# EAGLE design cirkel (EAGLE 5.11)
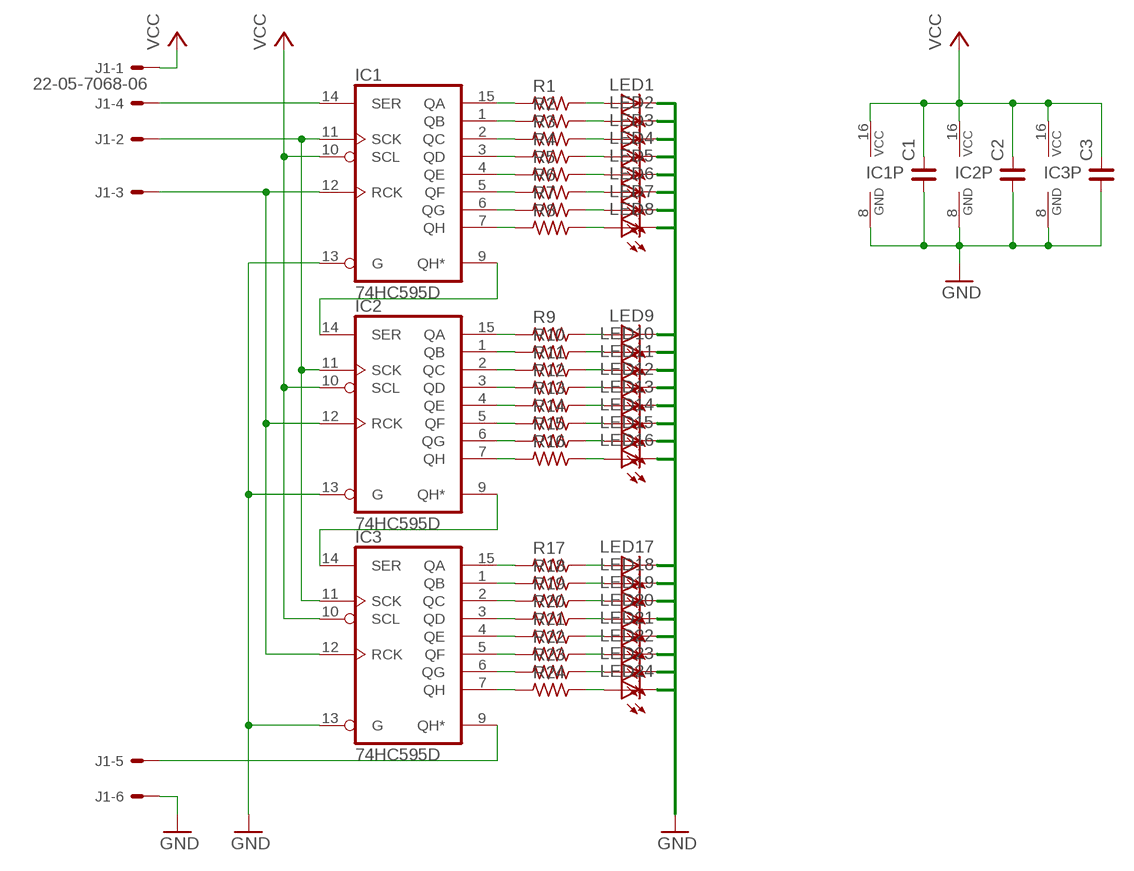
[diagram p0: schematic, sheet 1]

## Parts
C1  C_0805  [C0805]
C2  C_0805  [C0805]
C3  C_0805  [C0805]
IC1  74HC595D  [SO16]
IC2  74HC595D  [SO16]
IC3  74HC595D  [SO16]
J1  22-05-7068-06  [7395-06]
LED1  LEDKA-3528ASYC  [KA-3528ASYC]
LED2  LEDKA-3528ASYC  [KA-3528ASYC]
LED3  LEDKA-3528ASYC  [KA-3528ASYC]
LED4  LEDKA-3528ASYC  [KA-3528ASYC]
LED5  LEDKA-3528ASYC  [KA-3528ASYC]
LED6  LEDKA-3528ASYC  [KA-3528ASYC]
LED7  LEDKA-3528ASYC  [KA-3528ASYC]
LED8  LEDKA-3528ASYC  [KA-3528ASYC]
LED9  LEDKA-3528ASYC  [KA-3528ASYC]
LED10  LEDKA-3528ASYC  [KA-3528ASYC]
LED11  LEDKA-3528ASYC  [KA-3528ASYC]
LED12  LEDKA-3528ASYC  [KA-3528ASYC]
LED13  LEDKA-3528ASYC  [KA-3528ASYC]
LED14  LEDKA-3528ASYC  [KA-3528ASYC]
LED15  LEDKA-3528ASYC  [KA-3528ASYC]
LED16  LEDKA-3528ASYC  [KA-3528ASYC]
LED17  LEDKA-3528ASYC  [KA-3528ASYC]
LED18  LEDKA-3528ASYC  [KA-3528ASYC]
LED19  LEDKA-3528ASYC  [KA-3528ASYC]
LED20  LEDKA-3528ASYC  [KA-3528ASYC]
LED21  LEDKA-3528ASYC  [KA-3528ASYC]
LED22  LEDKA-3528ASYC  [KA-3528ASYC]
LED23  LEDKA-3528ASYC  [KA-3528ASYC]
LED24  LEDKA-3528ASYC  [KA-3528ASYC]
R1  R_0805  [R0805]
R2  R_0805  [R0805]
R3  R_0805  [R0805]
R4  R_0805  [R0805]
R5  R_0805  [R0805]
R6  R_0805  [R0805]
R7  R_0805  [R0805]
R8  R_0805  [R0805]
R9  R_0805  [R0805]
R10  R_0805  [R0805]
R11  R_0805  [R0805]
R12  R_0805  [R0805]
R13  R_0805  [R0805]
R14  R_0805  [R0805]
R15  R_0805  [R0805]
R16  R_0805  [R0805]
R17  R_0805  [R0805]
R18  R_0805  [R0805]
R19  R_0805  [R0805]
R20  R_0805  [R0805]
R21  R_0805  [R0805]
R22  R_0805  [R0805]
R23  R_0805  [R0805]
R24  R_0805  [R0805]

## Nets
GND: C1.1 C2.1 C3.1 IC1.8(GND) IC1.13(G) IC2.8(GND) IC2.13(G) IC3.8(GND) IC3.13(G) J1.6 LED1.C LED2.C LED3.C LED4.C LED5.C LED6.C LED7.C LED8.C LED9.C LED10.C LED11.C LED12.C LED13.C LED14.C LED15.C LED16.C LED17.C LED18.C LED19.C LED20.C LED21.C LED22.C LED23.C LED24.C
N$1: IC1.15(QA) R1.1
N$2: IC1.1(QB) R2.1
N$3: IC1.2(QC) R3.1
N$4: IC1.3(QD) R4.1
N$5: IC1.4(QE) R5.1
N$6: IC1.5(QF) R6.1
N$7: IC1.6(QG) R7.1
N$8: IC1.7(QH) R8.1
N$9: IC2.15(QA) R9.1
N$10: IC2.1(QB) R10.1
N$11: IC2.2(QC) R11.1
N$12: IC2.3(QD) R12.1
N$13: IC2.4(QE) R13.1
N$14: IC2.5(QF) R14.1
N$15: IC2.6(QG) R15.1
N$16: IC2.7(QH) R16.1
N$17: IC3.15(QA) R17.1
N$18: IC3.1(QB) R18.1
N$19: IC3.2(QC) R19.1
N$20: IC3.3(QD) R20.1
N$21: IC3.4(QE) R21.1
N$22: IC3.5(QF) R22.1
N$23: IC3.6(QG) R23.1
N$24: IC3.7(QH) R24.1
N$25: LED1.A R1.2
N$26: LED2.A R2.2
N$27: LED3.A R3.2
N$28: LED4.A R4.2
N$29: LED5.A R5.2
N$30: LED6.A R6.2
N$31: LED7.A R7.2
N$32: LED8.A R8.2
N$33: LED9.A R9.2
N$34: LED10.A R10.2
N$35: LED11.A R11.2
N$36: LED12.A R12.2
N$37: LED13.A R13.2
N$38: LED14.A R14.2
N$39: LED15.A R15.2
N$40: LED16.A R16.2
N$41: LED17.A R17.2
N$42: LED18.A R18.2
N$43: LED19.A R19.2
N$44: LED20.A R20.2
N$45: LED21.A R21.2
N$46: LED22.A R22.2
N$47: LED23.A R23.2
N$48: LED24.A R24.2
N$52: IC1.9(QH*) IC2.14(SER)
N$53: IC2.9(QH*) IC3.14(SER)
N$54: IC1.14(SER) J1.4
N$55: IC1.11(SCK) IC2.11(SCK) IC3.11(SCK) J1.2
N$57: IC1.12(RCK) IC2.12(RCK) IC3.12(RCK) J1.3
N$59: IC3.9(QH*) J1.5
VCC: C1.2 C2.2 C3.2 IC1.10(SCL) IC1.16(VCC) IC2.10(SCL) IC2.16(VCC) IC3.10(SCL) IC3.16(VCC) J1.1

## Library data of the parts
C1-C3 = rc-master:C_: NON-POLARIZED CAP
IC1-IC3 = 74xx-eu:74*595: 8-bit SHIFT REGISTER, output latch
J1 = con-molex:22-?-06: CONNECTOR wire to board 2.54 mm (.1 inch) pitch header; OC_FARNELL: unknown; OC_NEWARK: unknown
LED1-LED24 = led:LED: LED OSRAM: - CHIPLED LG R971, LG N971, LY N971, LG Q971, LY Q971, LO R971, LY R971 LH N974, LH R974 LS Q976, LO Q976, LY Q976 LO Q996 - Hyper CHIPLED LW Q18S LB Q993, LB Q99A, LB R99A - SideLED LS A670, LO A670, LY A670, LG A670, LP A670 LB A673, LV A673, LT A673, LW A673 LH A674 LY A675 LS A676, LA A676, LO A676, LY A676, LW A676 LS A679, LY A679, LG A679 - Hyper Micro SIDELED® LS Y876, LA Y876, LO Y876, LY Y876 LT Y87S - SmartLED LW L88C, LW L88S LB L89C, LB L89S, LG L890 LS L89K, LO L89K, LY L89K LS L896, LA L896, LO L896, LY L896 - TOPLED LS T670, LO T670, LY T670, LG T670, LP T670 LSG T670, LSP T670, LSY T670, LOP T670, LYG T670 LG T671, LOG T671, LSG T671 LB T673, LV T673, LT T673, LW T673 LH T674 LS T676, LA T676, LO T676, LY T676, LB T676, LH T676, LSB T676, LW T676 LB T67C, LV T67C, LT T67C, LS T67K, LO T67K, LY T67K, LW E67C LS E67B, LA E67B, LO E67B, LY E67B, LB E67C, LV E67C, LT E67C LW T67C LS T679, LY T679, LG T679 LS T770, LO T770, LY T770, LG T770, LP T770 LB T773, LV T773, LT T773, LW T773 LH T774 LS E675, LA E675, LY E675, LS T675 LS T776, LA T776, LO T776, LY T776, LB T776 LHGB T686 LT T68C, LB T68C - Hyper Mini TOPLED® LB M676 - Mini TOPLED Santana® LG M470 LS M47K, LO M47K, LY M47K Source: http://www.osram.convergy.de LUXEON: - LUMILED® LXK2-PW12-R00, LXK2-PW12-S00, LXK2-PW14-U00, LXK2-PW14-V00 LXK2-PM12-R00, LXK2-PM12-S00, LXK2-PM14-U00 LXK2-PE12-Q00, LXK2-PE12-R00, LXK2-PE12-S00, LXK2-PE14-T00, LXK2-PE14-U00 LXK2-PB12-K00, LXK2-PB12-L00, LXK2-PB12-M00, LXK2-PB14-N00, LXK2-PB14-P00, LXK2-PB14-Q00 LXK2-PR12-L00, LXK2-PR12-M00, LXK2-PR14-Q00, LXK2-PR14-R00 LXK2-PD12-Q00, LXK2-PD12-R00, LXK2-PD12-S00 LXK2-PH12-R00, LXK2-PH12-S00 LXK2-PL12-P00, LXK2-PL12-Q00, LXK2-PL12-R00 Source: www.luxeon.com KINGBRIGHT: KA-3528ASYC Source: www.kingbright.com
R1-R24 = rc-master:R_: RESISTOR

## Board
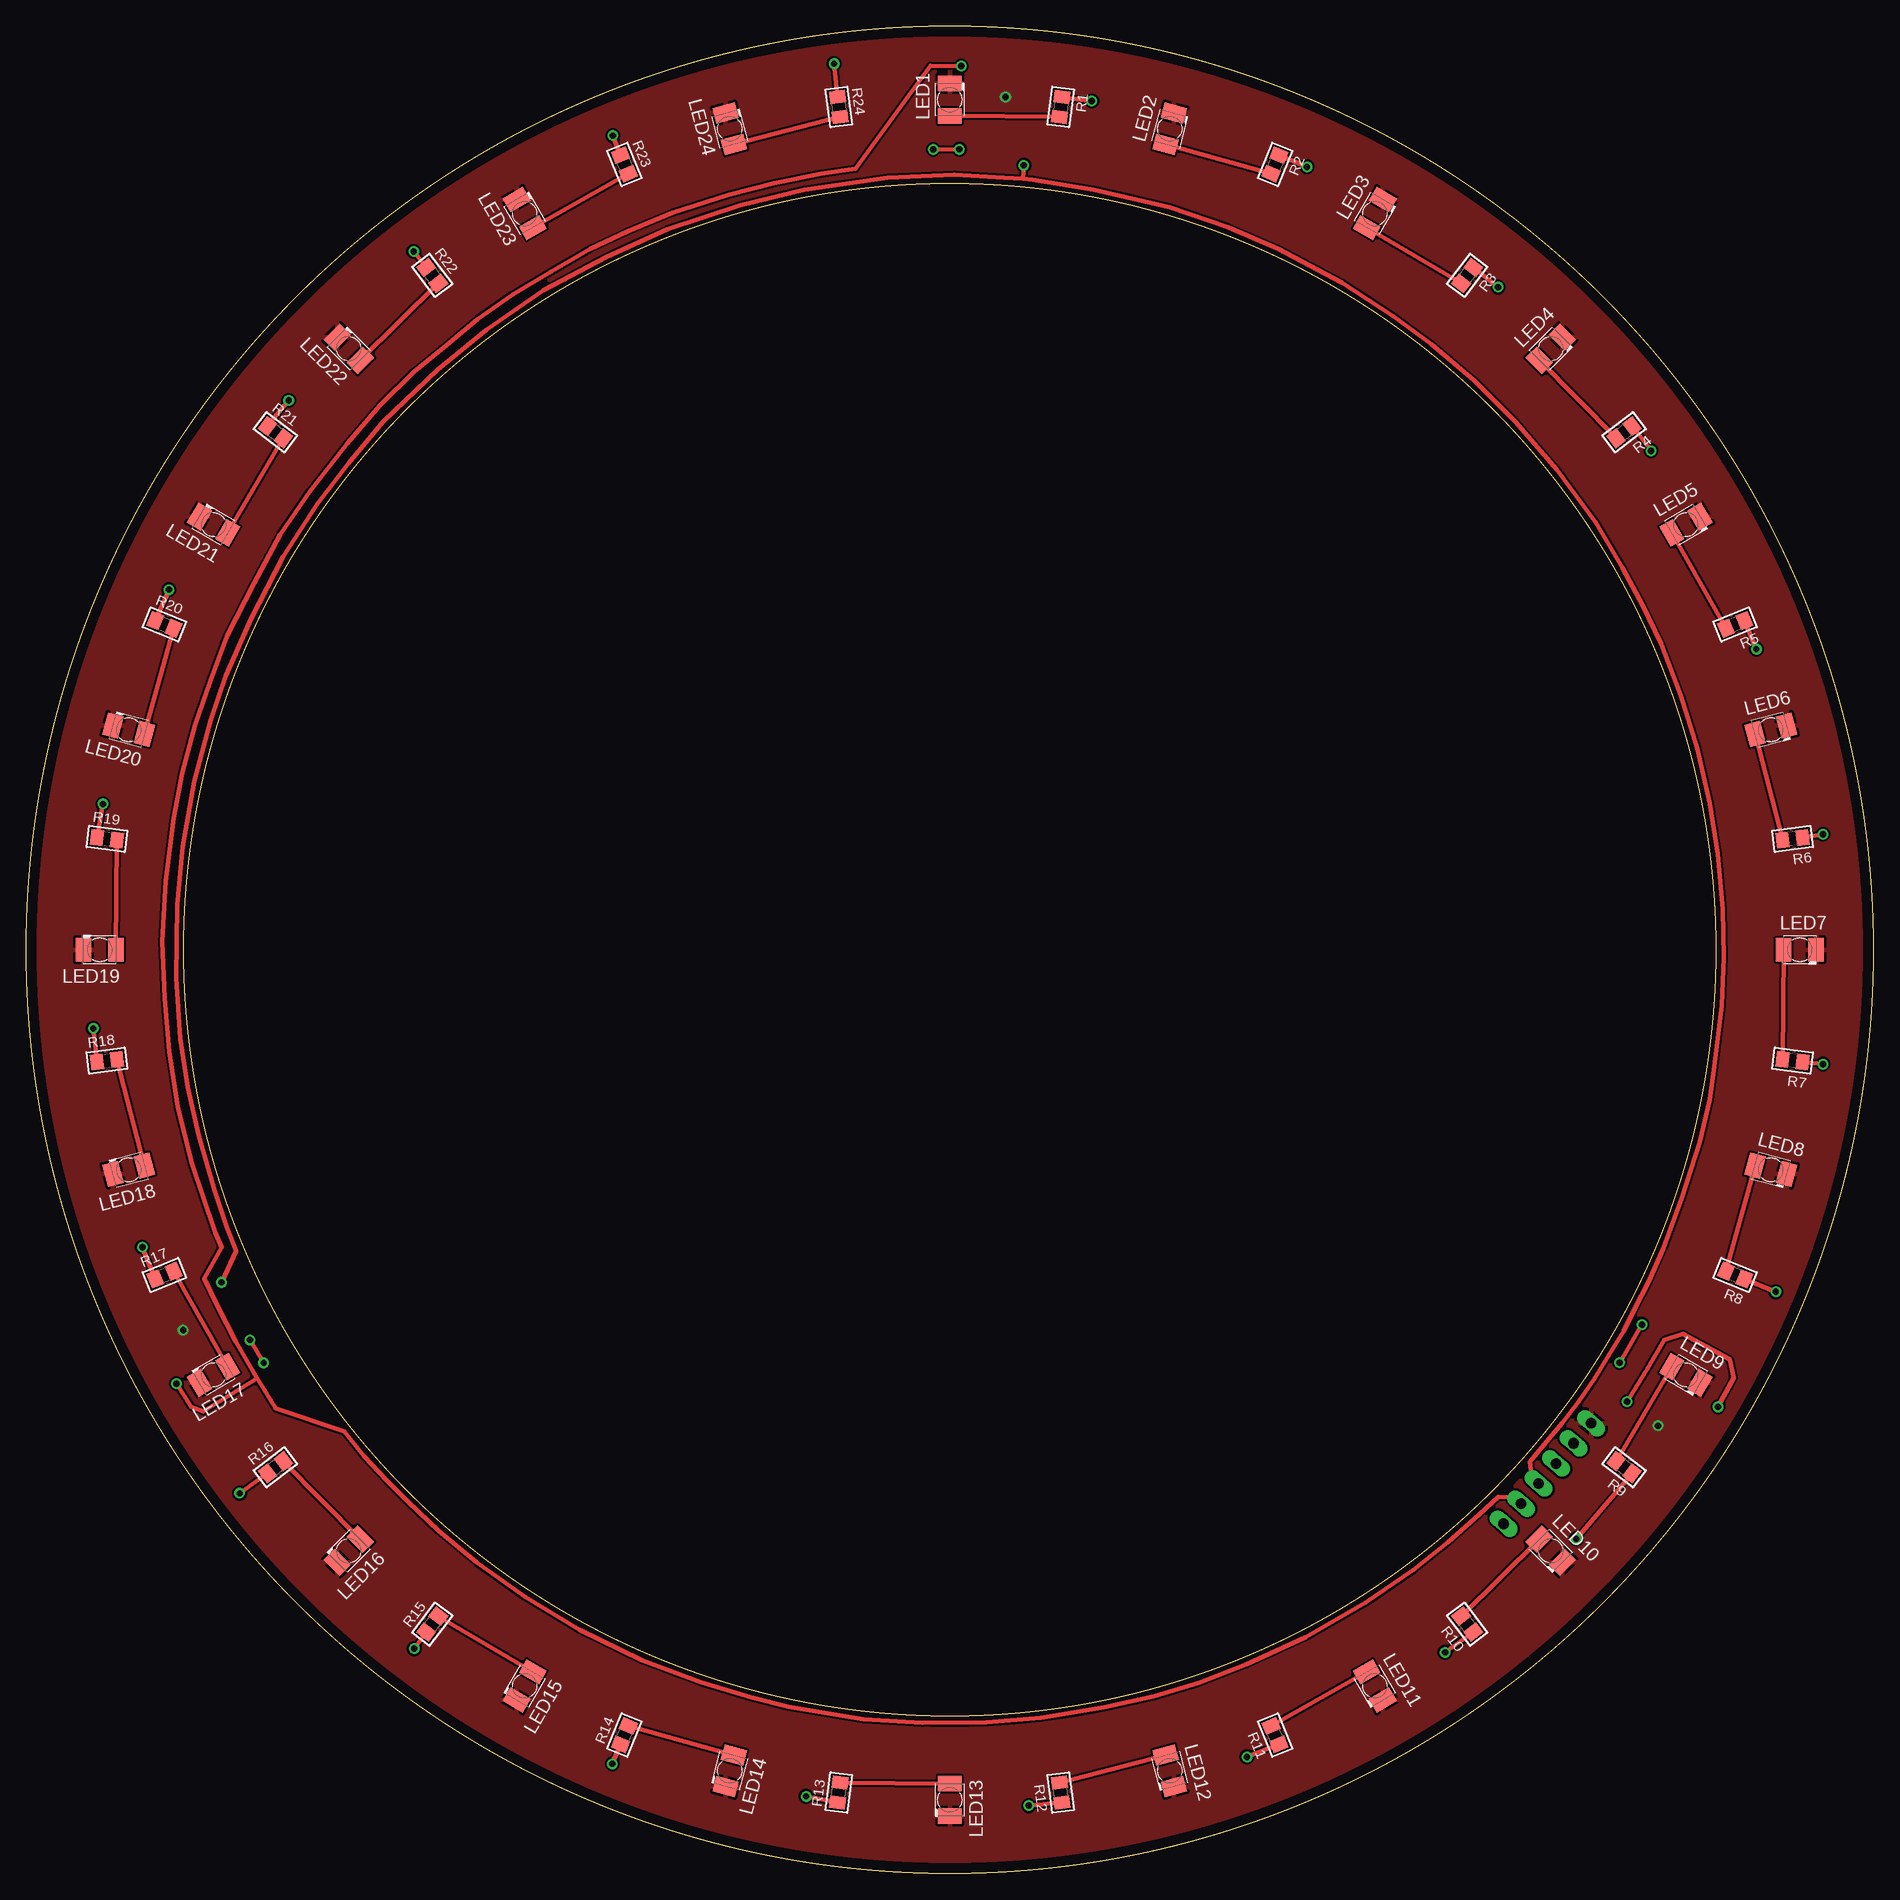
[diagram p1: board, top side]
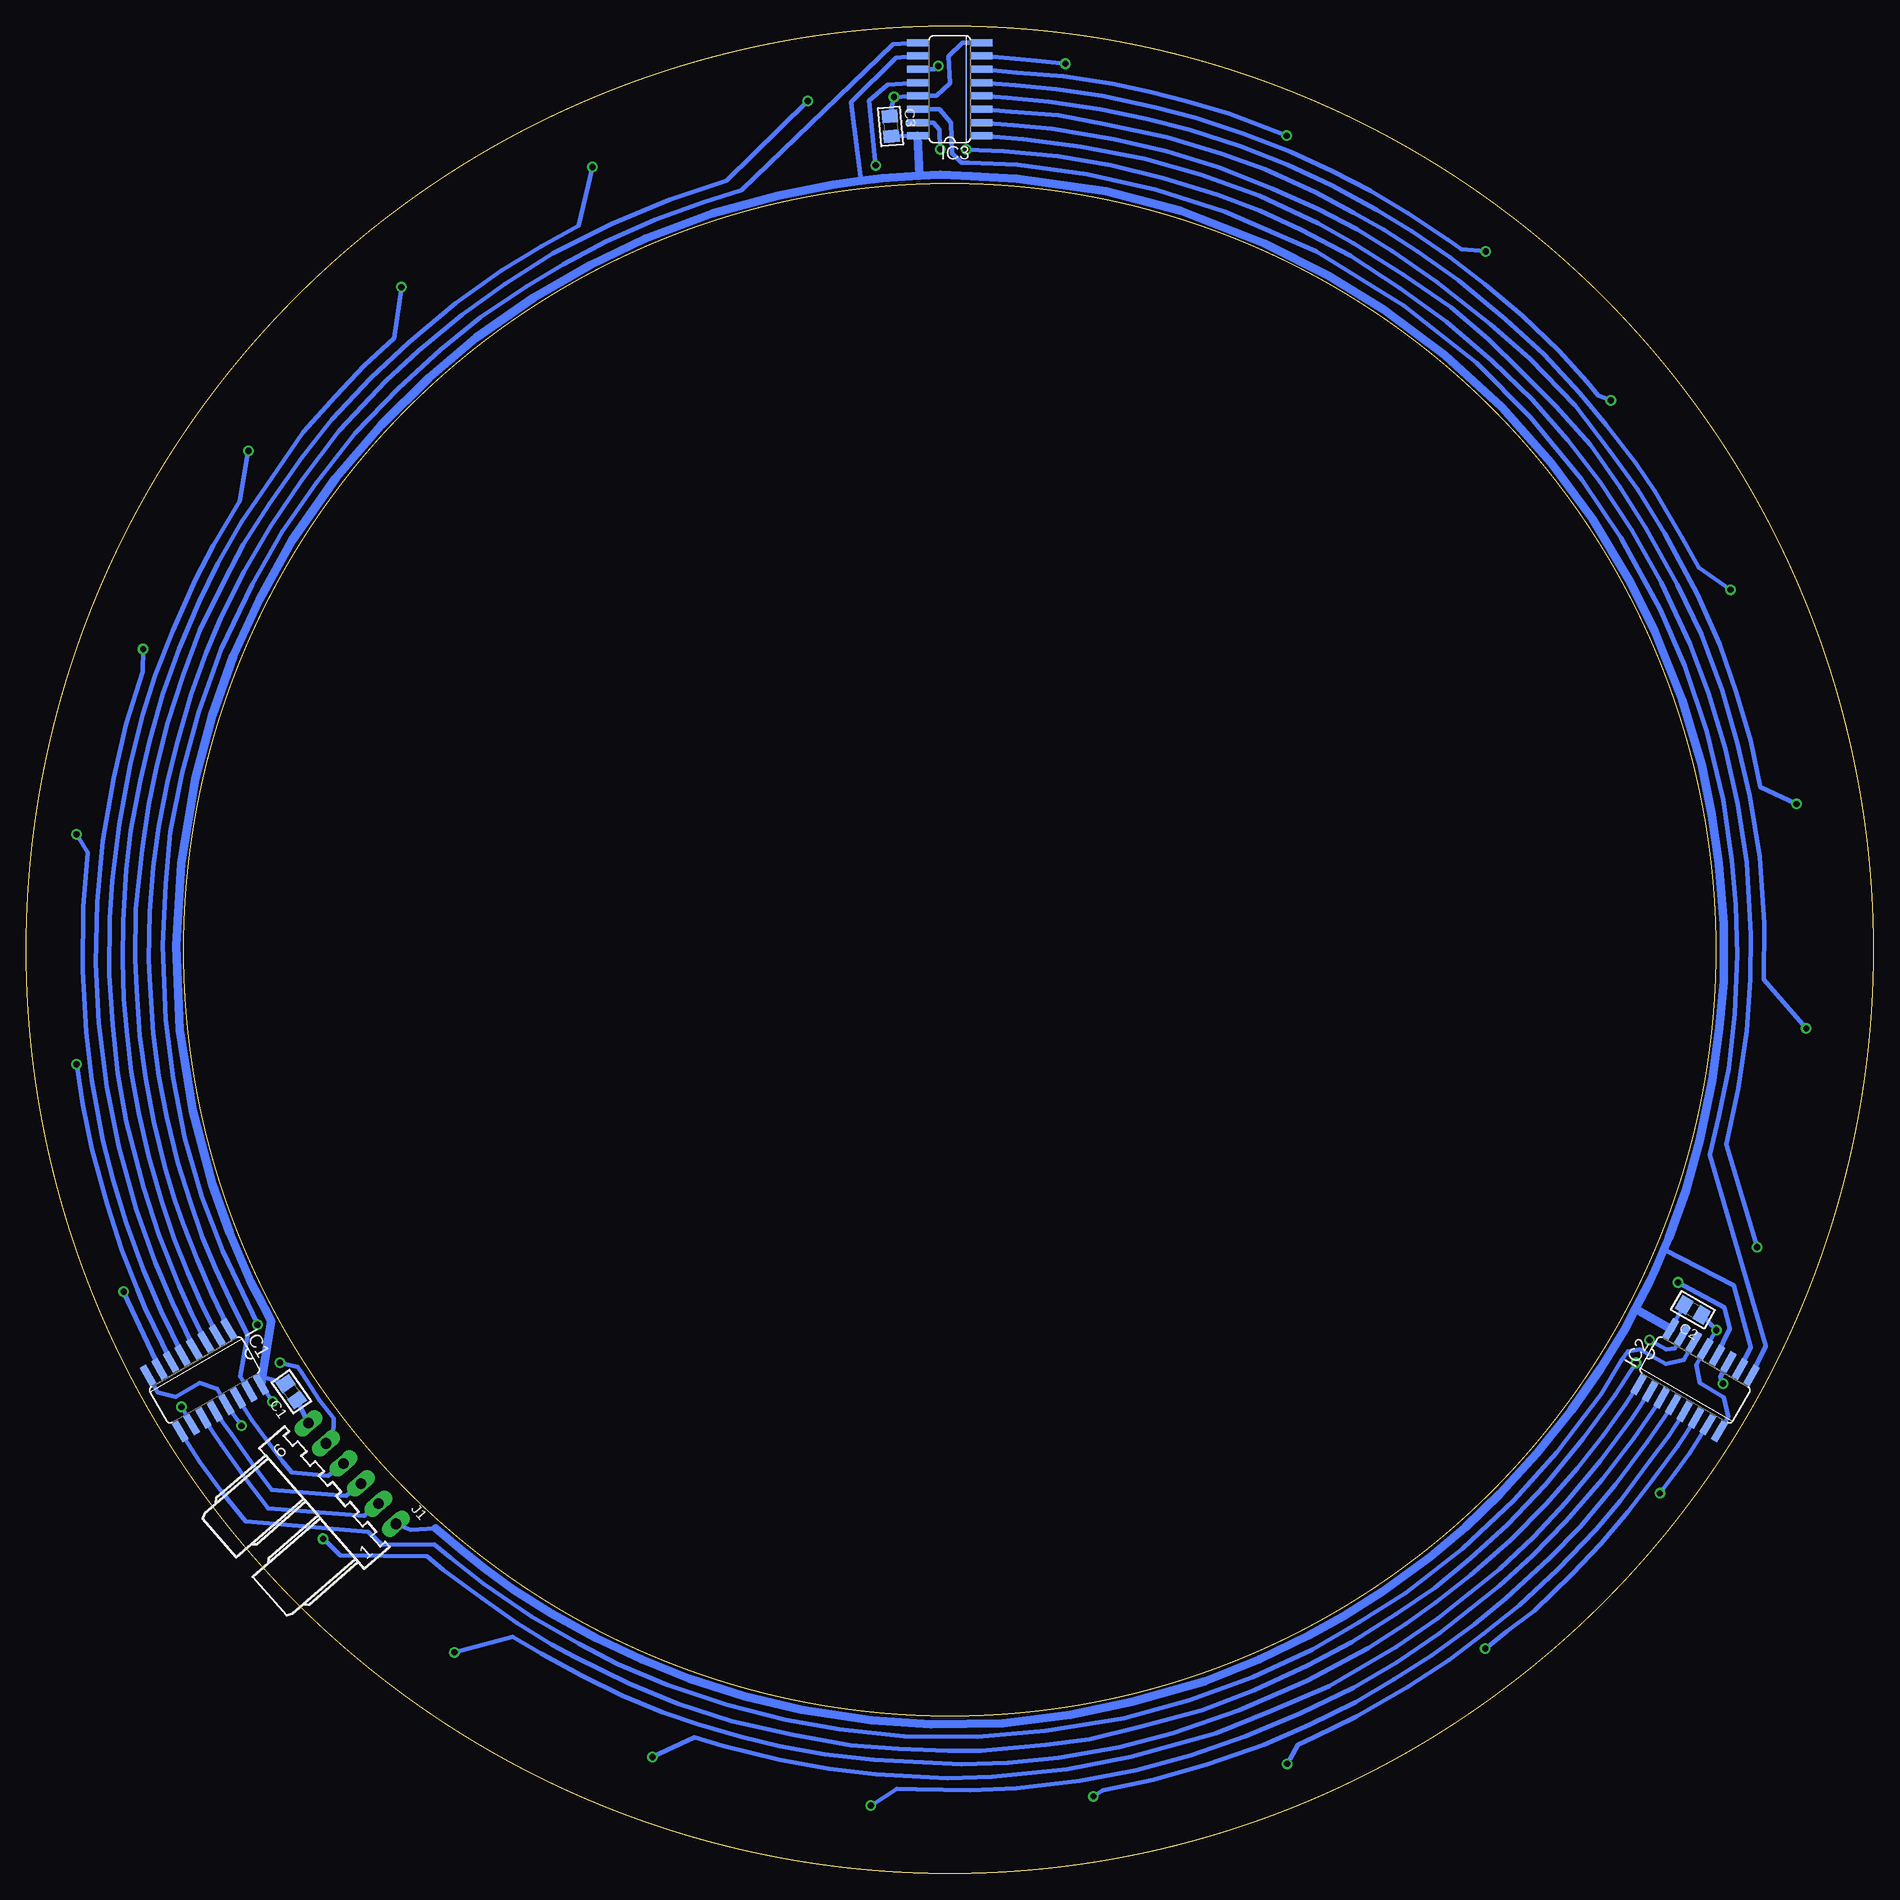
[diagram p2: board, bottom side, seen from below]

Size 176 x 176 mm. Coordinates in mm from the lower left corner, seen from the top.
Outline: circle at 88,88 radius 73
Outline: circle at 88,88 radius 88
Copper layers (1*16): Top 0.035mm / dielectric 1.5mm / Bottom 0.035mm
Design rules "default": minimum track width 10mil, minimum drill 0.6mm, track to track 8mil, track to pad 8mil, pad to pad 8mil, via to via 8mil, smd to smd 8mil, copper to edge 40mil, drill to drill 8mil, minimum pad ring 10mil, minimum via ring 8mil, stop-mask expansion 4mil, vias tented up to drill 0mil, thermal gap 10mil

### Footprints (pad centres in the part's own frame; a part is rotated, then mirrored left to right if it is on the bottom)
C0805 = smd 1.2 x 1.5: 1 -0.953,0; 2 0.953,0
SO16 = smd 0.66 x 2.032: 1 -4.445,-3.073; 2 -3.175,-3.073; 3 -1.905,-3.073; 4 -0.635,-3.073; 5 0.635,-3.073; 6 1.905,-3.073; 7 3.175,-3.073; 8 4.445,-3.073; 9 4.445,3.073; 10 3.175,3.073; 11 1.905,3.073; 12 0.635,3.073; 13 -0.635,3.073; 14 -1.905,3.073; 15 -3.175,3.073; 16 -4.445,3.073
7395-06 = drill 1.016 long: 1 6.35,0; 2 3.81,0; 3 1.27,0; 4 -1.27,0; 5 -3.81,0; 6 -6.35,0
KA-3528ASYC = smd 1.5 x 2.2: A -1.55,0; C 1.55,0
R0805 = smd 1.2 x 1.5: 1 -0.953,0; 2 0.953,0

### Placement (x,y rotation side)
C1  150.74,45.89 125 bottom
C2  17.18,53.68 150 bottom
C3  93.64,166.46 275 bottom
IC1  159.01,47 210 bottom
IC2  16.99,47 330 bottom
IC3  88,170 90 bottom
J1  144.95,38.09 311 bottom
LED1  88,169 90 top
LED2  108.96,166.24 75 top
LED3  128.5,158.15 60 top
LED4  145.28,145.28 45 top
LED5  158.15,128.5 30 top
LED6  166.24,108.96 15 top
LED7  169,88 0 top
LED8  166.24,67.04 345 top
LED9  158.15,47.5 330 top
LED10  145.28,30.72 315 top
LED11  128.5,17.85 300 top
LED12  108.96,9.76 285 top
LED13  88,7 270 top
LED14  67.04,9.76 255 top
LED15  47.5,17.85 240 top
LED16  30.72,30.72 225 top
LED17  17.85,47.5 210 top
LED18  9.76,67.04 195 top
LED19  7,88 180 top
LED20  9.76,108.96 165 top
LED21  17.85,128.5 150 top
LED22  30.72,145.28 135 top
LED23  47.5,158.15 120 top
LED24  67.04,166.24 105 top
R1  98.57,168.31 262.5 top
R2  119,162.83 247.5 top
R3  137.31,152.26 232.5 top
R4  152.26,137.31 217.5 top
R5  162.83,119 202.5 top
R6  168.31,98.57 187.5 top
R7  168.31,77.43 172.5 top
R8  162.83,57 157.5 top
R9  152.26,38.69 142.5 top
R10  137.31,23.74 127.5 top
R11  119,13.17 112.5 top
R12  98.57,7.69 97.5 top
R13  77.43,7.69 82.5 top
R14  57,13.17 67.5 top
R15  38.69,23.74 52.5 top
R16  23.74,38.69 37.5 top
R17  13.17,57 22.5 top
R18  7.69,77.43 7.5 top
R19  7.69,98.57 352.5 top
R20  13.17,119 337.5 top
R21  23.74,137.31 322.5 top
R22  38.69,152.26 307.5 top
R23  57,162.83 292.5 top
R24  77.43,168.31 277.5 top

### Tracks (layer width: path | path; a pad name or v marks a point on that pad's centre or on a via)
GND  (via drill 0.6)
  Bottom 0.406: IC1.8 163.49,45.81 161.76,45.38 LED9.C 157.8,46.17 IC1.13 v155.49,42.64 | IC2.8 13.81,43.47 14.24,45.35 LED17.C 16.86,48.45 IC2.13 v14.95,51.75 C2.1 | IC3.8 86.78,174.44 88.1,173.14 LED1.C 89.27,169.36 IC3.13 v93.31,169.25 C3.1 | J1.6 C1.1
  pour Top: -2.17,90.54 4.18,151.5 71.49,188.33 164.2,179.44 184.52,137.53 192.14,33.39 127.37,-7.25 21.96,-7.25 -14.87,88 -12.33,90.54
N$1  (via drill 0.6)
  Top 0.406: v101.54,168.87 R1.1
  Bottom 0.406: IC1.15 155.59,47.36 154.88,51.32 156.25,53.94 157.95,57.6 159.22,60.64 160.39,64.02 161.58,67.76 162.6,72.07 163.39,75.99 163.89,80.02 164.22,85.26 164.33,87.09 164.22,91.58 163.89,95.9 163.39,99.76 162.5,104.1 161.58,107.89 160.29,112.36 158.84,116.32 157.47,119.62 155.28,123.99 152.72,128.39 149.7,132.81 146.17,137.45 141.75,142.18 138.6,145.07 134.48,148.53 130.42,151.42 125.8,154.4 120.16,157.16 114.69,159.48 109.28,161.3 v101.54,168.87
N$2  (via drill 0.6)
  Top 0.406: v122.04,162.6 R2.1
  Bottom 0.406: IC1.1 158.33,55.23 159.73,58.48 161.03,61.86 161.84,64.15 162.75,67.17 163.84,71.62 164.61,75.73 165.17,79.8 165.5,84.17 165.6,87.14 165.55,91.89 164.96,97.55 164.33,101.82 163.59,105.53 162.5,109.64 161.03,114.16 159.45,118.4 157.09,123.23 155.33,126.61 152.85,130.44 149.7,134.94 146.88,138.52 143.19,142.46 139.54,145.89 135.09,149.59 130.75,152.72 126.91,155.03 123.36,156.99 v122.04,162.6
N$3  (via drill 0.6)
  Top 0.406: v140.25,151.14 R3.1
  Bottom 0.406: IC1.2 159.27,54.22 160.59,57.24 161.91,60.44 163.08,64 164.35,68.31 165.29,72.43 166,76.37 166.44,80.28 166.69,83.38 166.82,87.03 166.74,90.74 166.46,95.64 166.05,99.38 165.14,104.05 164.25,107.94 163.01,112.36 161.43,116.7 159.53,121.17 157.75,124.81 155.46,128.79 152.62,132.96 149.59,137.3 146.52,140.76 143.78,143.65 140.93,146.27 v140.25,151.14
N$4  (via drill 0.6)
  Top 0.406: v154.83,135.55 R4.1
  Bottom 0.406: IC1.3 160.21,53.28 161.43,55.97 163.39,60.87 164.81,65.32 166.49,71.64 167.27,76.21 167.76,80.84 168.09,85.66 168.06,91 167.81,94.53 167.15,99.94 166.11,105.63 164.91,110.4 163.69,114.16 162.04,118.35 159.86,123.33 158.18,126.53 155.67,130.75 v154.83,135.55
N$5  (via drill 0.6)
  Top 0.406: v164.86,116.65 R5.1
  Bottom 0.406: IC1.4 162.07,54.29 163.69,58.21 165.52,63.26 167.2,69.25 168.34,75 169.1,81.04 169.38,86.7 169.23,92.57 168.72,98.34 167.68,104.38 166.49,109.54 164.91,114.52 v164.86,116.65
N$6  (via drill 0.6)
  Top 0.406: v171.21,99 R6.1
  Bottom 0.406: IC1.5 163.13,53.53 164.86,57.52 166.49,61.99 167.73,66.03 168.7,69.89 169.74,75.61 170.3,80.18 170.63,86.04 170.55,92.09 170.14,97.27 v171.21,99
N$7  (via drill 0.6)
  Top 0.406: v171.21,77.1 R7.1
  Bottom 0.406: IC1.6 164.71,53.91 165.44,55.67 166.92,59.4 168.29,63.72 169.76,69.05 170.63,73.27 v171.21,77.1
N$8  (via drill 0.6)
  Top 0.406: v166.72,55.41 R8.1
  Bottom 0.406: IC1.7 166.33,54.55 v166.72,55.41
N$9  (via drill 0.6)
  Top 0.406: v147.72,31.87 R9.1 | v22.62,48.63 v21.33,50.81
  Bottom 0.406: v22.62,48.63 24.63,45.53 27.62,41.42 31.26,37.02 34.89,33.21 38.37,29.99 41.77,27.22 45.45,24.7 49.72,21.98 53.86,19.83 58.99,17.44 63.97,15.51 69.86,13.93 74.66,12.77 78.83,12.23 85.03,11.65 88.18,11.65 92.88,11.85 97.45,12.21 102.94,13.2 108.75,14.49 113.88,16.14 118.5,18.07 123.76,20.61 125.87,21.76 129.28,23.86 132.58,26.18 136.28,28.89 137.78,30.19 146.06,30.29 147.38,31.56 v147.72,31.87 | v21.33,50.81 19.72,49.9 18.91,50.03 IC2.15
N$10  (via drill 0.6)
  Top 0.406: R10.1 v135.19,21.05
  Bottom 0.406: IC2.1 23.59,44.74 25.72,41.75 28.18,38.57 31.16,35.22 34.58,31.74 38.37,28.39 41.67,25.8 44.52,23.79 48.15,21.45 53.99,18.35 60.47,15.51 66.77,13.35 71.87,12 77.64,11.01 82.46,10.53 86.88,10.4 90.56,10.56 95.24,10.81 99.91,11.34 104.18,12.11 107.86,13.02 111.98,14.19 115.36,15.36 119.19,16.93 123.05,18.81 126.89,20.89 129.66,22.54 v135.19,21.05
N$11  (via drill 0.6)
  Top 0.406: R11.1 v116.32,11.09
  Bottom 0.406: IC2.2 22.98,43.4 26.02,39.31 29.27,35.35 32.35,32.04 35.65,28.95 38.45,26.73 41.47,24.27 45.43,21.58 51.88,17.79 57.37,15.48 62.62,13.32 70.75,11.11 76.82,9.89 83.96,9.18 88.23,9.06 95.04,9.44 99.48,9.97 104.2,10.83 109.67,12.13 112.31,12.94 v116.32,11.09
N$12  (via drill 0.6)
  Top 0.406: R12.1 v95.52,6.44
  Bottom 0.406: IC2.3 22.8,41.44 25.82,37.56 29.27,33.52 32.5,30.24 35.65,27.37 38.37,25.21 41.37,22.87 45.38,20.11 49.54,17.67 54.57,15.25 59.83,13.05 65.04,11.24 70.25,9.82 75.61,8.83 81.62,8.12 86.07,7.91 91.17,7.99 93,8.07 v95.52,6.44
N$13  (via drill 0.6)
  Top 0.406: R13.1 v74.31,7.33
  Bottom 0.406: IC2.4 21.53,41.11 24.6,37.02 27.95,32.98 30.88,29.99 34.99,26.18 38.01,23.74 42.05,20.77 45.68,18.48 49.37,16.27 53.73,14.16 58.08,12.23 63.44,10.4 68.59,8.9 73.39,7.89 v74.31,7.33
N$14  (via drill 0.6)
  Top 0.406: R14.1 v55.84,10.43
  Bottom 0.406: IC2.5 19.47,41.7 21.27,39.28 24.12,35.5 26.43,32.73 30.06,28.97 33.72,25.54 37.15,22.8 40.4,20.36 44.34,17.77 49.29,14.92 53.2,12.99 54.8,12.23 v55.84,10.43
N$15  (via drill 0.6)
  Top 0.406: R15.1 v36.97,21.4
  Bottom 0.406: IC2.6 18.61,40.7 20.97,37.58 23.36,34.48 25.97,31.41 28.72,28.49 32.3,25.01 34.91,23.05 v36.97,21.4
N$16  (via drill 0.6)
  Top 0.406: R16.1 v20.33,36.21
  Bottom 0.406: IC2.7 17.49,40.07 18.91,38.11 v20.33,36.21
N$17  (via drill 0.6)
  Top 0.406: v11.06,59.65 R17.1 | v86.42,164.25 v88.91,164.28
  Bottom 0.406: v86.42,164.25 82.82,164.1 77.69,163.62 72.63,162.75 67.63,161.53 62.47,159.93 58.43,158.43 54.52,156.63 49.82,154.14 45.1,151.02 40.65,147.84 36.29,144.11 32.53,140.48 29.12,136.54 26.05,132.6 23,127.98 20.18,122.98 17.49,117.19 15.74,112.51 14.11,107.18 12.92,101.84 12.05,96.31 11.67,89.4 11.72,85.21 12.05,80.28 12.87,74.79 13.98,69.46 v11.06,59.65 | v88.91,164.28 88.99,166.16 89.55,166.82 IC3.15
N$18  (via drill 0.6)
  Top 0.406: v6.39,80.51 R18.1
  Bottom 0.406: IC3.1 80.96,165.24 75.48,164.53 69.46,163.36 64.07,161.86 58.51,159.83 52.9,157.22 49.52,155.33 44.77,152.34 40.25,149.24 36.69,146.19 33.62,143.19 30.24,139.79 26.96,136.13 24.12,132.02 21.66,128.18 18.68,122.8 16.4,118.1 14.36,112.69 12.94,107.71 11.78,102.66 10.81,96.84 10.38,90.49 10.43,85.16 v6.39,80.51
N$19  (via drill 0.6)
  Top 0.406: v7.3,101.89 R19.1
  Bottom 0.406: IC3.2 81.9,166.56 78.25,166.23 72.35,165.24 67.38,164.1 62.4,162.57 57.24,160.54 52.87,158.59 49.19,156.66 45.81,154.55 41.62,151.65 36.46,147.59 32.73,144.34 28.41,139.87 25.11,135.52 22.42,131.87 19.85,127.65 16.75,121.91 14.64,117.06 13.07,112.49 11.67,107.86 10.76,103.52 v7.3,101.89
N$20  (via drill 0.6)
  Top 0.406: v13.6,122.31 R20.1
  Bottom 0.406: IC3.3 82.16,167.83 77.66,167.5 73.19,166.66 67.32,165.42 62.12,163.84 57.95,162.37 53.18,160.19 49.54,158.26 46.62,156.63 43.4,154.5 39.54,151.81 35.07,148.1 31.41,144.74 27.95,141.03 25.41,138.01 22.65,134.38 20.82,131.71 18.2,127.24 16.63,124.42 v13.6,122.31
N$21  (via drill 0.6)
  Top 0.406: v25.01,140.35 R21.1
  Bottom 0.406: IC3.4 82.56,169.18 78.55,168.82 73.67,168.11 69.31,167.2 65.14,166.13 60.29,164.56 55.84,162.8 51.63,160.85 47.34,158.51 43.96,156.45 40.35,154.01 37,151.4 33.44,148.4 29.96,145.07 27.24,142.08 26.18,140.81 v25.01,140.35
N$22  (via drill 0.6)
  Top 0.406: R22.1 v36.92,154.55
  Bottom 0.406: IC3.5 81.73,170.37 77.81,169.99 73.5,169.38 68.49,168.29 64.58,167.27 60.01,165.75 55.54,164.05 51.55,162.17 47.92,160.31 44.36,158.21 40.55,155.67 39.23,154.78 v36.92,154.55
N$23  (via drill 0.6)
  Top 0.406: R23.1 v55.89,165.57
  Bottom 0.406: IC3.6 81.6,171.59 77.15,171.24 72.48,170.53 68.95,169.76 65.44,168.85 61.36,167.65 57.85,166.33 v55.89,165.57
N$24  (via drill 0.6)
  Top 0.406: R24.1 v76.98,172.43
  Bottom 0.406: IC3.7 81.78,172.91 79.75,172.73 v76.98,172.43
N$25
  Top 0.406: LED1.A R1.2
N$26
  Top 0.406: LED2.A R2.2
N$27
  Top 0.406: LED3.A R3.2
N$28
  Top 0.406: LED4.A R4.2
N$29
  Top 0.406: R5.2 LED5.A
N$30
  Top 0.406: R6.2 LED6.A
N$31
  Top 0.406: R7.2 LED7.A
N$32
  Top 0.406: R8.2 LED8.A
N$33
  Top 0.406: R9.2 LED9.A
N$34
  Top 0.406: LED10.A R10.2
N$35
  Top 0.406: LED11.A R11.2
N$36
  Top 0.406: LED12.A R12.2
N$37
  Top 0.406: LED13.A R13.2
N$38
  Top 0.406: LED14.A R14.2
N$39
  Top 0.406: LED15.A R15.2
N$40
  Top 0.406: LED16.A R16.2
N$41
  Top 0.406: R17.2 LED17.A
N$42
  Top 0.406: R18.2 LED18.A
N$43
  Top 0.406: R19.2 LED19.A
N$44
  Top 0.406: R20.2 LED20.A
N$45
  Top 0.406: R21.2 LED21.A
N$46
  Top 0.406: LED22.A R22.2
N$47
  Top 0.406: LED23.A R23.2
N$48
  Top 0.406: LED24.A R24.2
N$52
  Bottom 0.406: IC1.9 159.45,39.21 157.37,36.34 155.11,33.52 143.42,32.55 142.08,31.31 137.12,31.36 135.57,30.04 132.4,27.6 127.9,24.48 123.31,21.88 119.62,19.93 114.95,17.97 109.23,16.07 103.65,14.64 98.52,13.7 92.37,13.05 85.36,12.99 78.88,13.55 71.41,14.77 65.22,16.47 59.15,18.66 53.51,21.3 49.04,23.89 44.54,26.73 39.16,30.93 34.25,35.52 30.14,40.12 25.92,45.66 24.02,48.88 23.41,49.72 22.27,49.92 19.78,48.53 18.05,48.94 IC2.14
N$53
  Bottom 0.406: IC2.9 10.22,50.23 15.58,68.47 14.7,72.1 13.76,76.67 13.2,81.88 12.97,87.49 13.09,92.27 13.48,96.53 14.29,102.25 15.86,108.8 17.97,115.05 20.31,120.41 24.04,127.29 27.78,132.81 32.68,138.78 37.81,143.96 44.74,149.39 53.13,154.57 61.76,158.33 68.37,160.44 74.92,161.89 81.52,162.83 86.17,162.98 86.86,162.98 87.8,163.89 87.9,166.82 88.97,168.09 IC3.14
N$54
  Bottom 0.406: IC1.14 154.5,43.22 153.2,41.39 151.6,39.31 150.69,38.19 147.23,37.86 J1.4
N$55  (via drill 0.6)
  Top 0.406: J1.2 141.85,35.83 140.27,35.88 138.44,34.2 135.47,31.51 132.17,28.89 127.65,25.82 121.91,22.49 116.27,19.93 111.75,18.15 107.46,16.88 102.71,15.81 96.69,14.8 91.48,14.39 85.38,14.31 79.77,14.67 72.63,15.86 69.08,16.75 64.3,18.17 58.66,20.31 52.74,23.2 47.54,26.35 42.91,29.6 39.28,32.63 36.41,35.37 34.33,37.45 32.2,39.74 30.29,42.1 23.78,44.29 22.72,46.01 22.01,47.15 | 22.01,47.15 21.71,47.64 19.95,50.69 18.15,54.19 16.96,56.68 18.61,59.65 18.02,61.08 15.79,67.68 14.44,73.06 13.6,78.32 13.17,83.35 12.97,88.79 13.3,94.55 14.03,100.55 14.87,104.81 16.12,109.44 17.52,113.58 19.17,117.95 21.71,122.95 24.22,127.57 27.06,131.71 30.57,136.21 33.75,139.92 36.97,143.09 40.05,145.63 43.02,148.1 46.37,150.41 50,152.62 53.76,154.8 57.37,156.45 61.61,158.26 66.99,159.96 71.26,161.05 75.73,161.94 79.01,162.45 86.17,172.23 v89.09,172.2 | v14.31,46.65 15.71,44.44 16.86,44.03 22.01,47.15
  Bottom 0.406: IC1.11 157.44,40.88 155.08,37.58 152.95,34.79 143.78,34.08 J1.2 | IC2.11 14.59,47.31 v14.31,46.65 | IC3.11 89.47,171.9 v89.09,172.2
N$57  (via drill 0.6)
  Top 0.406: J1.3 143.47,37.73 143.3,39.18 144.62,40.81 146.4,42.94 147.94,44.97 149.42,47.11 150.76,49.29 152.21,51.68 153.25,53.73 154.6,56.38 156,59.53 157.77,64.33 159.48,69.69 160.42,73.75 160.87,76.88 161.58,82.67 161.76,87.26 161.69,91.83 161.18,97.14 160.44,101.92 159.25,107.18 157.65,112.23 155.82,117.11 154.04,120.79 152.08,124.42 149.54,128.69 145.84,133.77 141.9,138.34 137.94,142.28 133.9,145.68 130.34,148.32 125.36,151.55 119.29,154.8 114.49,156.86 108.93,158.74 101.69,160.42 95.9,161.38 94.96,161.46 | 94.96,161.46 v95.06,162.75 | 94.96,161.46 93.16,161.58 88.46,161.84 82.08,161.58 74.16,160.44 68.06,158.97 61.13,156.68 55.26,154.01 49.32,150.84 43.88,147.11 39.21,143.3 34,138.34 30.72,134.35 27.7,130.44 24.48,125.47 21.43,119.57 18.99,114.06 17.57,109.87 15.99,104.03 14.9,97.83 14.36,92.27 14.29,85.31 14.67,79.57 15.41,74.94 16.42,70.32 17.95,65.01 19.09,61.61 20.03,59.32 v18.61,56.3
  Bottom 0.406: IC1.12 156.43,41.82 154.29,38.77 152.59,36.54 145.53,35.98 J1.3 | IC2.12 13.68,51.93 14.21,53.91 v18.61,56.3 | IC3.12 93.94,170.45 95.7,168.9 v95.06,162.75
N$59  (via drill 0.6)
  Top 0.406: v151.83,48.66 v153.96,52.29
  Bottom 0.406: IC3.9 93.39,174.28 107.84,160.39 111.47,159.22 116.09,157.57 120.79,155.49 124.78,153.33 128.39,151.17 132.68,148.27 136.51,145.2 140.55,141.47 144.64,137.22 148.38,132.47 151.63,127.83 154.45,122.77 157.42,116.65 159.58,110.66 161.13,104.87 162.3,99.23 162.7,94.27 162.98,88.41 162.7,81.32 161.99,75.73 160.92,70.07 159.3,64.5 157.29,59.3 v153.96,52.29 | J1.5 146.78,41.47 146.72,43.35 148.07,45.12 149.7,47.64 150.13,48.25 v151.83,48.66
VCC  (via drill 0.6)
  Top 0.406: v161.2,44.44 162.73,47.18 162.35,48.99 157.85,51.37 156.07,50.84 154.45,48.07 v152.54,44.95
  Bottom 0.406: J1.1 139.38,32.73 136.97,32.86 | v161.2,44.44 IC1.10 | IC2.10 11.65,50.1 13.27,56 19.96,59.42 | IC3.10 93.11,173.01 97.42,168.75 96.46,161.26 | IC1.16 v152.54,44.95 | 153.51,47.28 C1.2 | IC2.16 C2.2 | IC3.16 C3.2
  Bottom 0.813: 136.97,32.86 134.38,30.67 132.27,29.02 129.55,27.02 125.97,24.78 121.76,22.44 117.36,20.41 112.79,18.53 107.53,16.86 102.12,15.58 95.44,14.59 89.8,14.19 82.92,14.29 76.49,15.1 70.65,16.32 63.67,18.28 58.48,20.39 53.79,22.67 50.48,24.48 46.73,26.86 42.2,30.16 38.85,32.96 35.6,36.16 32.04,39.99 28.77,44.11 26,48.07 25.6,48.72 23.69,51.8 22.66,53.77 | 22.66,53.77 21.3,56.38 20.79,57.55 19.96,59.42 19.5,60.54 17.87,65.04 16.52,69.89 15.36,75.58 14.67,80.56 14.26,84.98 14.26,90.46 14.72,96.2 15.41,100.83 16.35,105.6 18.17,111.8 20.82,118.33 23.13,123.03 26.76,129.1 30.67,134.35 35.4,139.69 40.83,144.64 46.65,149.01 51.93,152.21 57.98,155.28 66,158.41 73.12,160.29 81.57,161.48 85.11,161.67 85.92,161.71 88.86,161.86 90.89,161.74 | 90.89,161.74 94.48,161.53 95.24,161.43 96.46,161.26 99.1,160.9 104.38,159.86 110.53,158.18 117.03,155.74 122.27,153.23 127.65,150.15 133.11,146.34 137.61,142.51 142.18,137.99 146.52,132.96 150.66,127.04 153.74,121.43 156.28,115.99 158.28,110.3 159.91,104.26 161.25,96.23 161.71,88.41 161.36,80.36 160.16,72.71 158.28,65.67 156.63,61.02 154.62,56.35 153.53,54.28 153.29,53.82 152.67,52.64 153.51,47.28 IC1.16 | 22.66,53.77 IC2.16 | 90.89,161.74 IC3.16